# EAGLE design board1_attiny85 (EAGLE 8.6.1)
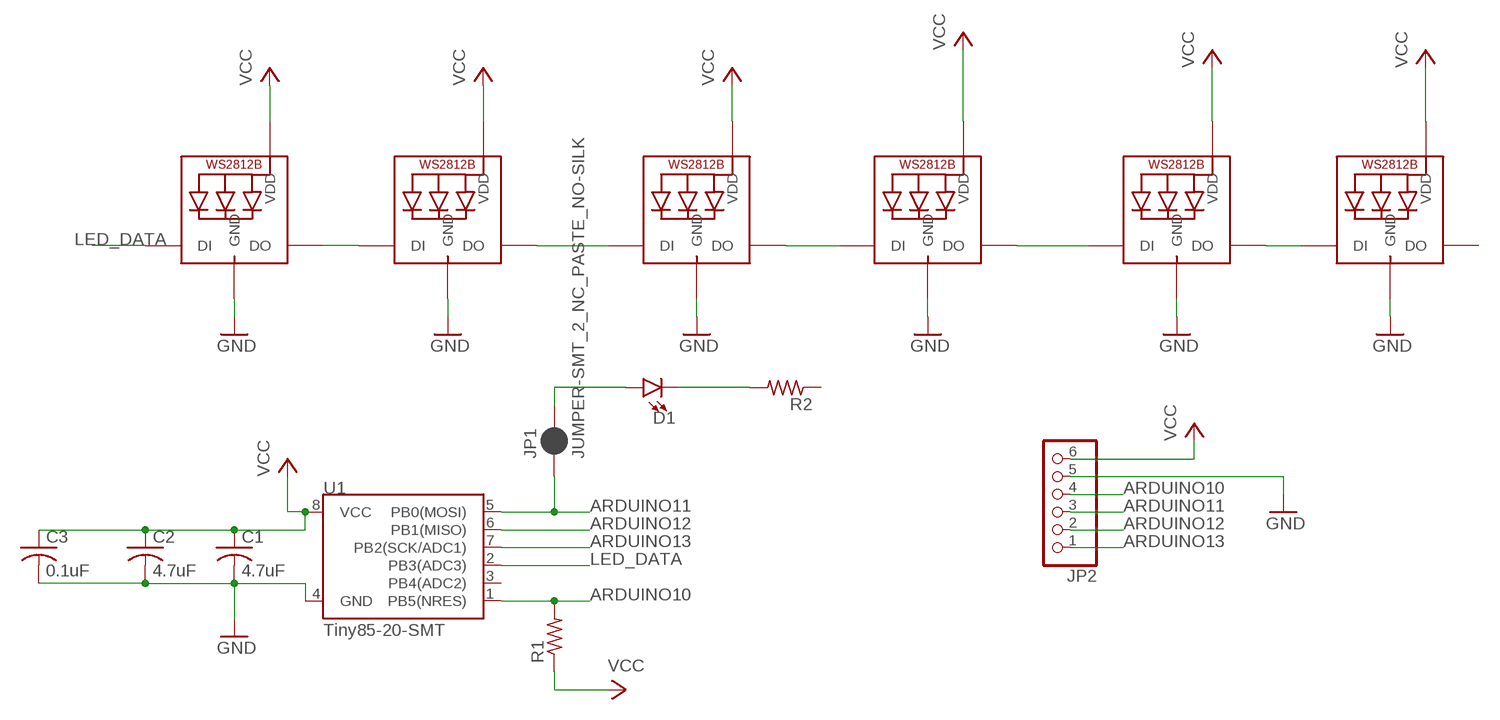
[diagram p0: schematic, sheet 1]

## Parts
C1  4.7uF  C-USC0603  [C0603]
C2  4.7uF  C-USC0603  [C0603]
C3  0.1uF  C-USC0603  [C0603]
D1  LED0603  [LED-0603]
JP1  JUMPER-SMT_2_NC_PASTE_NO-SILK  [SMT-JUMPER_2_NC_PASTE_NO-SILK]
JP2  PINHD-1X6  [1X06]
LED1  WS2812B5050  [WS2812B]
LED2  WS2812B5050  [WS2812B]
LED3  WS2812B5050  [WS2812B]
LED4  WS2812B5050  [WS2812B]
LED5  WS2812B5050  [WS2812B]
LED6  WS2812B5050  [WS2812B]
R1  R-US_R0603  [R0603]
R2  R-US_R0603  [R0603]
U1  Tiny85-20-SMT  ATTINY45TINY85-20-SMT  [SO08-EIAJ_MCU]

## Nets
ARDUINO10: JP2.4 R1.2 U1.1(PB5(NRES))
ARDUINO11: JP1.1 JP2.3 U1.5(PB0(MOSI))
ARDUINO12: JP2.2 U1.6(PB1(MISO))
ARDUINO13: JP2.1 U1.7(PB2(SCK/ADC1))
GND: C1.2 C2.2 C3.2 JP2.5 LED1.3-GND(GND) LED2.3-GND(GND) LED3.3-GND(GND) LED4.3-GND(GND) LED5.3-GND(GND) LED6.3-GND(GND) U1.4(GND)
LED_DATA: LED1.4-DIN(DI) U1.2(PB3(ADC3))
N$2: LED1.2-DOUT(DO) LED2.4-DIN(DI)
N$4: D1.C R2.2
N$8: D1.A JP1.2
N$9: LED2.2-DOUT(DO) LED3.4-DIN(DI)
N$10: LED3.2-DOUT(DO) LED4.4-DIN(DI)
N$11: LED4.2-DOUT(DO) LED5.4-DIN(DI)
N$12: LED5.2-DOUT(DO) LED6.4-DIN(DI)
VCC: C1.1 C2.1 C3.1 JP2.6 LED1.1-VDD(VDD) LED2.1-VDD(VDD) LED3.1-VDD(VDD) LED4.1-VDD(VDD) LED5.1-VDD(VDD) LED6.1-VDD(VDD) R1.1 U1.8(VCC)
Unconnected: LED6.2-DOUT(DO) R2.1 U1.3(PB4(ADC2))

## Library data of the parts
C1-C3 = adafruit:C-US: CAPACITOR, American symbol
D1 = SparkFun-LED:LED: LED (Generic) Standard schematic elements and footprints for 5mm, 3mm, 1206, and 0603 sized LEDs. Generic LEDs with no color specified.
JP1 = SparkFun-Jumpers:JUMPER-SMT_2_NC_PASTE: Normally closed solder jumper This jumper has an aperture in the stencil to allow solder paste to bridge the split in the wire so it's normally closed (NC). Wick off the solder to open the connection. Reapply solder to reclose the connection.
JP2 = pinhead:PINHD-1X6: PIN HEADER
LED1-LED6 = adafruit:WS2812B
R1 R2 = adafruit:R-US_: RESISTOR, American symbol
U1 = SparkFun-Retired:ATTINY45: Atmel 8-pin 2/4/8kB flash uC Retired; PROD_ID: IC-09092

## Board
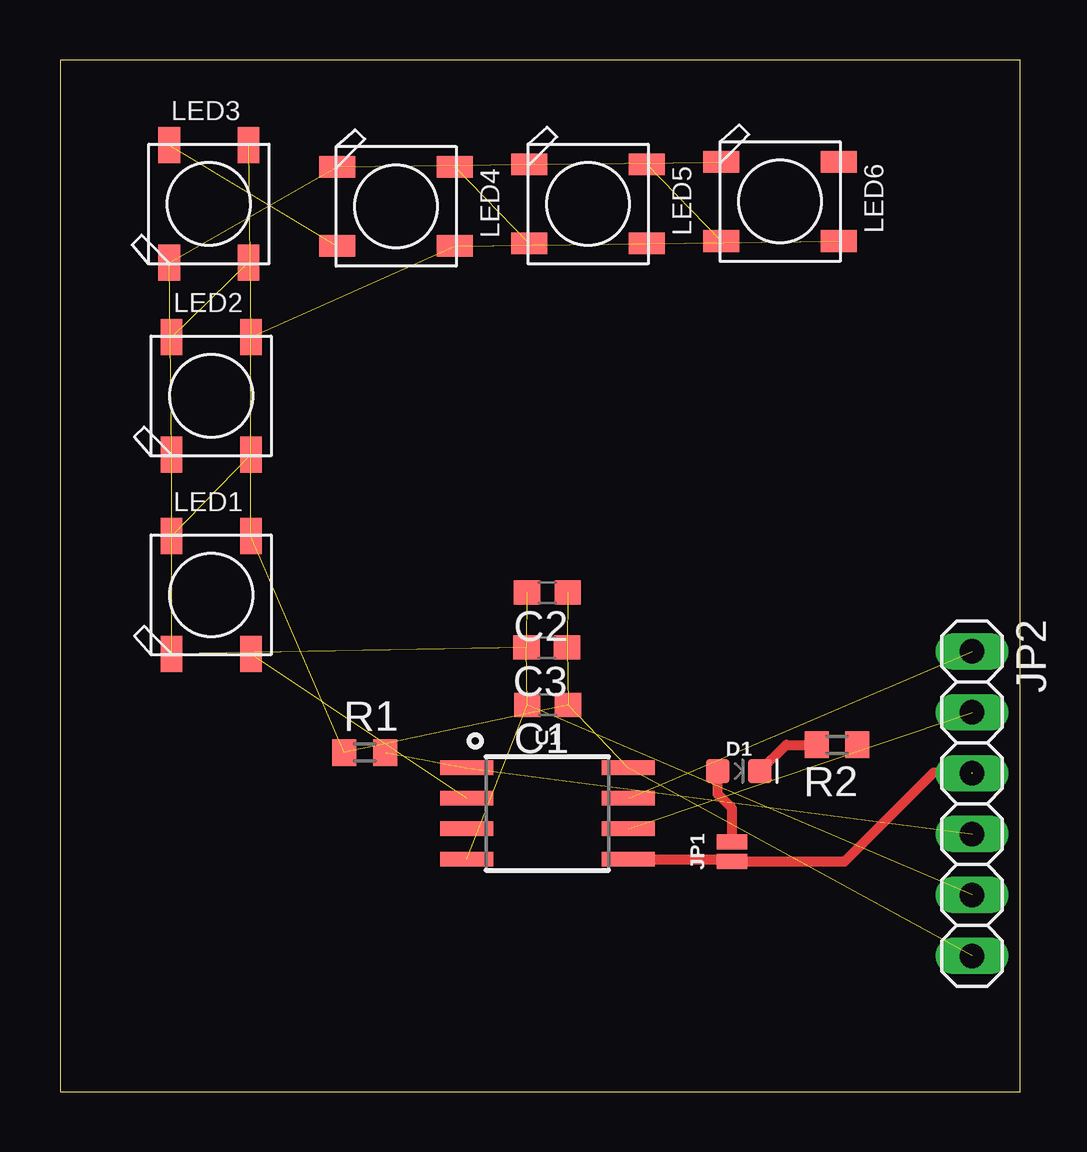
[diagram p1: board, top side]

Size 40 x 43 mm. Coordinates in mm from the lower left corner, seen from the top.
Outline: 0,0 40,0 40,43 0,43 0,0
Copper layers (1*16): Top 0.035mm / dielectric 1.5mm / Bottom 0.035mm
Design rules "default": minimum track width 6mil, minimum drill 0.35mm, track to track 6mil, track to pad 6mil, pad to pad 6mil, via to via 6mil, smd to smd 6mil, copper to edge 40mil, drill to drill 6mil, minimum pad ring 10mil, minimum via ring 8mil, stop-mask expansion 4mil, vias tented up to drill 0mil, thermal gap 10mil

### Footprints (pad centres in the part's own frame; a part is rotated, then mirrored left to right if it is on the bottom)
C0603 = smd 1.1 x 1: 1 -0.85,0; 2 0.85,0
LED-0603 = smd 1 x 1: A -0.877,0; C 0.877,0
SMT-JUMPER_2_NC_PASTE_NO-SILK = smd 0.635 x 1.27: 1 -0.406,0; 2 0.406,0
1X06 = drill 1.016 long: 1 -6.35,0; 2 -3.81,0; 3 -1.27,0; 4 1.27,0; 5 3.81,0; 6 6.35,0
WS2812B = smd 1.5 x 0.9: 1-VDD 2.45,-1.65; 2-DOUT 2.45,1.65; 3-GND -2.45,1.65; 4-DIN -2.45,-1.65
R0603 = smd 1 x 1.1: 1 -0.85,0; 2 0.85,0
SO08-EIAJ_MCU = smd 0.61 x 2.21: 1 -1.905,-3.378; 2 -0.635,-3.378; 3 0.635,-3.378; 4 1.905,-3.378; 5 1.905,3.353; 6 0.635,3.353; 7 -0.635,3.353; 8 -1.905,3.353

### Placement (x,y rotation side)
C1  20.32,16.12 180 top
C2  20.3,20.8 180 top
C3  20.28,18.5 180 top
D1  28.28,13.36 0 top
JP1  28,10 90 top
JP2  38,12 270 top
LED1  6.3,20.7 90 top
LED2  6.3,29 90 top
LED3  6.2,37 90 top
LED4  14,36.9 0 top
LED5  22,37 0 top
LED6  30,37.1 0 top
R1  12.7,14.13 0 top
R2  32.38,14.46 180 top
U1  20.32,11.59 270 top

### Tracks (layer width: path | path; a pad name or v marks a point on that pad's centre or on a via)
ARDUINO10  (2 unrouted)
ARDUINO11  (1 unrouted)
  Top 0.406: U1.5 27.91,9.68 JP1.1 32.69,9.59 36.4,13.3 37.97,13.3
ARDUINO12  (1 unrouted)
ARDUINO13  (1 unrouted)
GND  (10 unrouted)
LED_DATA  (1 unrouted)
N$2  (1 unrouted)
N$4
  Top 0.406: D1.C 30.26,14.46 R2.2
N$8
  Top 0.406: JP1.2 28,11.8 27.4,12.4 D1.A
N$9  (1 unrouted)
N$10  (1 unrouted)
N$11  (1 unrouted)
N$12  (1 unrouted)
VCC  (11 unrouted)